# EAGLE design ESP32_Receptor (EAGLE 9.6.2)
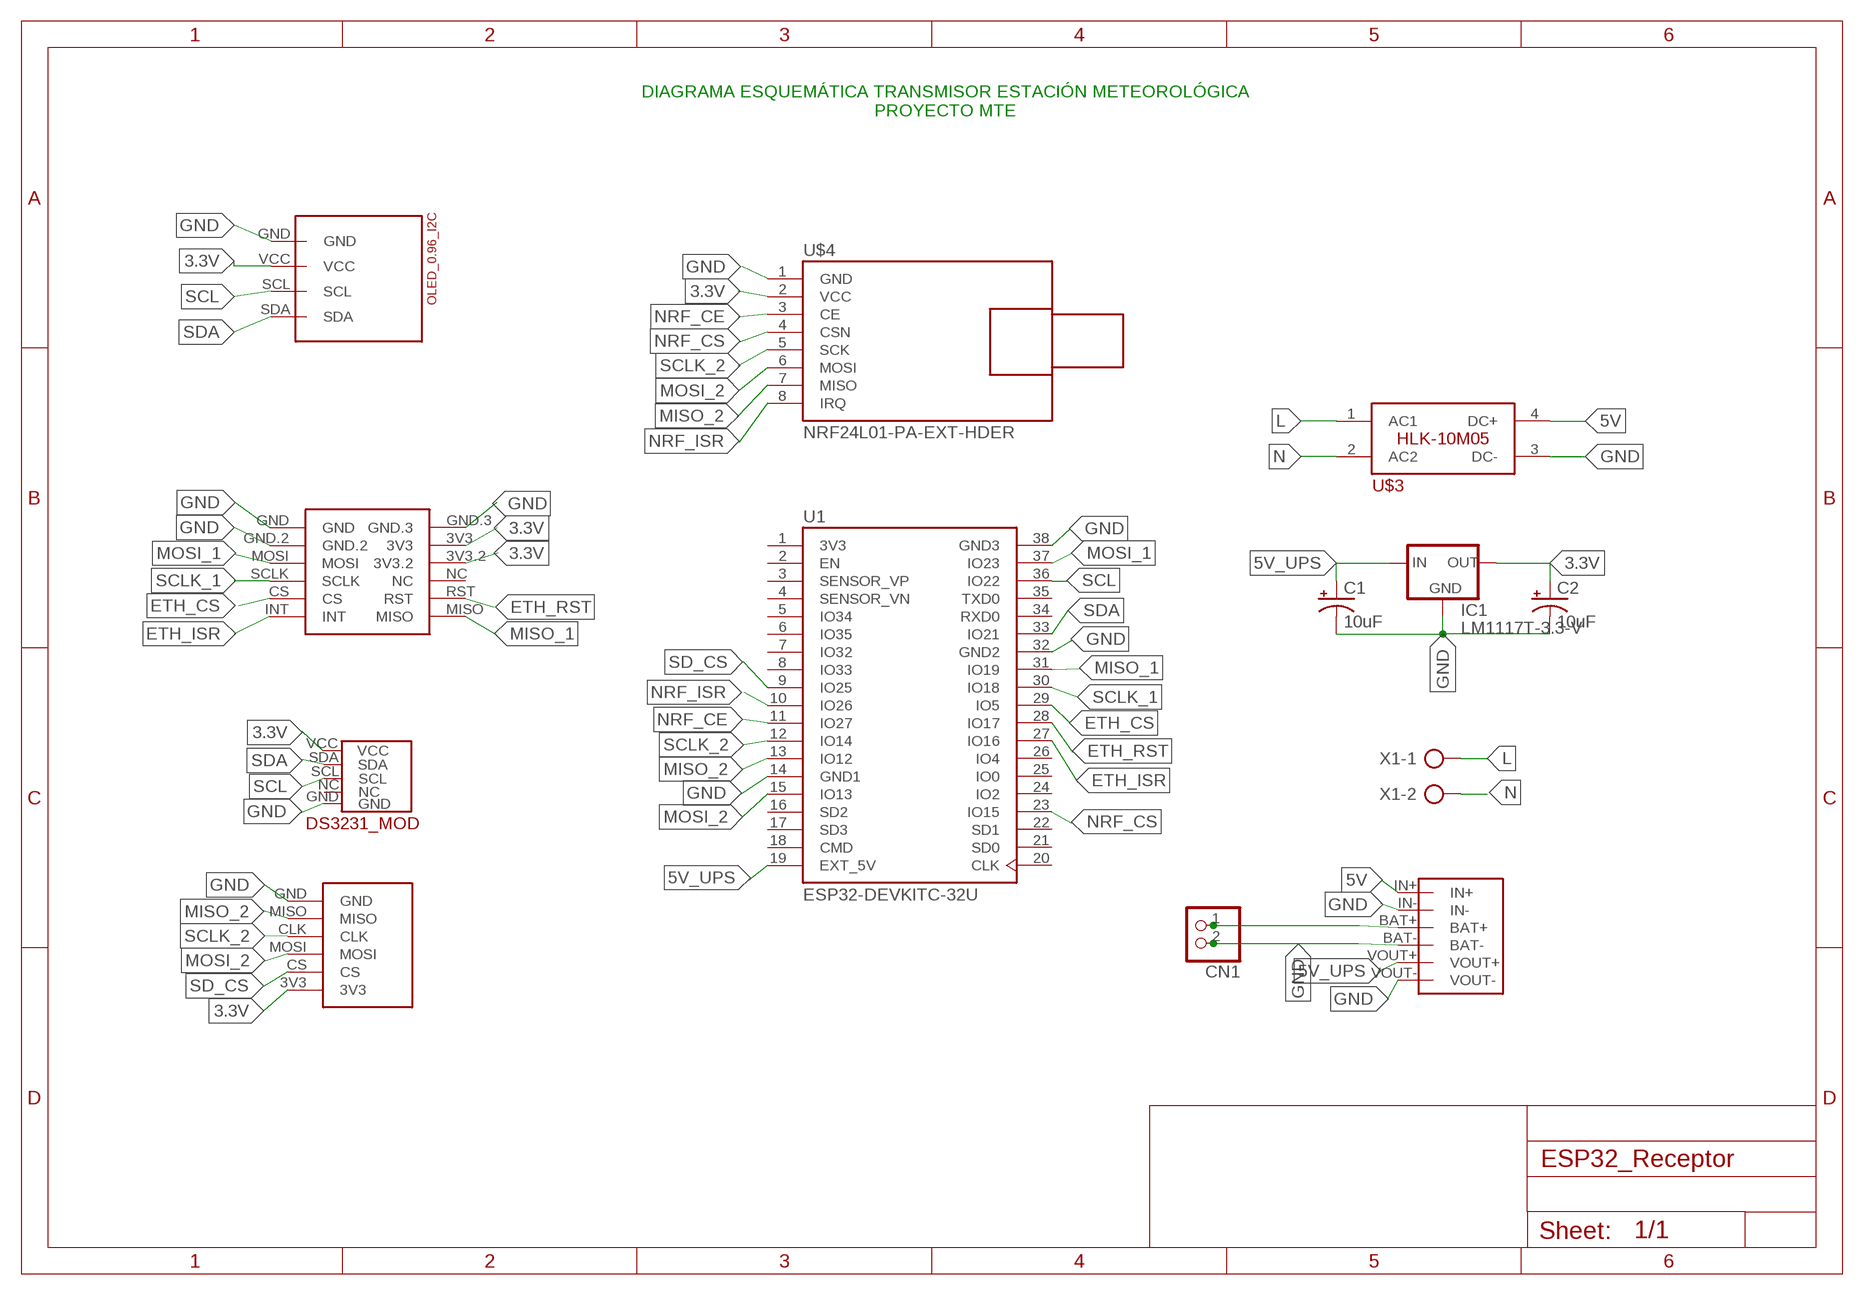
[diagram p0: schematic, sheet 1]

## Parts
C1  10uF  10UF-POLAR-RADIAL-2.5MM-25V-20%  [CPOL-RADIAL-2.5MM-5MM]
C2  10uF  10UF-POLAR-RADIAL-2.5MM-25V-20%  [CPOL-RADIAL-2.5MM-5MM]
CN1  JST_2PIN-THM  [JST-PH-2-THM]
IC1  LM1117T-3.3-V  [TO220V]
U1  ESP32-DEVKITC-32U  [MODULE_ESP32-DEVKITC-32U]
U$1  MINI_W5500  [MINI_W5500]
U$2  DS3231_MOD  [DS3231_MOD]
U$3  HLK-10M05  [HLK-10M05]
U$4  NRF24L01-PA-EXT-HDER  [NRF24L01-HEADER]
U$5  OLED_I2C_096  [OLED_096_I2C]
U$6  MODULO_MSD2  [MICROSD-BREAKOUT]
U$7  J5019_UPS  [J5019_UPS]
X1  AK500/2-H  [AK500/2-H]

## Nets
3.3V: C2.1(+) IC1.2(OUT) U$1.3V3 U$1.3V3.2 U$2.VCC U$4.2(VCC) U$5.VCC U$6.3V3
5V: U$3.4(DC+) U$7.IN+
5V_UPS: C1.1(+) IC1.3(IN) U1.19(EXT_5V) U$7.VOUT+
ETH_CS: U1.29(IO5) U$1.CS
ETH_ISR: U1.27(IO16) U$1.INT
ETH_RST: U1.28(IO17) U$1.RST
GND: C1.2(-) C2.2(-) CN1.2 IC1.1(GND) U1.14(GND1) U1.32(GND2) U1.38(GND3) U$1.GND U$1.GND.2 U$1.GND.3 U$2.GND U$3.3(DC-) U$4.1(GND) U$5.GND U$6.GND U$7.BAT- U$7.IN- U$7.VOUT-
L: U$3.1(AC1) X1.1
MISO_1: U1.31(IO19) U$1.MISO
MISO_2: U1.13(IO12) U$4.7(MISO) U$6.MISO
MOSI_1: U1.37(IO23) U$1.MOSI
MOSI_2: U1.15(IO13) U$4.6(MOSI) U$6.MOSI
N: U$3.2(AC2) X1.2
N$1: CN1.1 U$7.BAT+
NRF_CE: U1.11(IO27) U$4.3(CE)
NRF_CS: U1.23(IO15) U$4.4(CSN)
NRF_ISR: U1.10(IO26) U$4.8(IRQ)
SCL: U1.36(IO22) U$2.SCL U$5.SCL
SCLK_1: U1.30(IO18) U$1.SCLK
SCLK_2: U1.12(IO14) U$4.5(SCK) U$6.CLK
SD_CS: U1.9(IO25) U$6.CS
SDA: U1.33(IO21) U$2.SDA U$5.SDA
Unconnected: U1.2(EN) U1.3(SENSOR_VP) U1.4(SENSOR_VN) U1.5(IO34) U1.6(IO35) U1.7(IO32) U1.8(IO33) U1.16(SD2) U1.17(SD3) U1.18(CMD) U1.20(CLK) U1.21(SD0) U1.22(SD1) U1.24(IO2) U1.25(IO0) U1.26(IO4) U1.34(RXD0) U1.35(TXD0) U$1.NC U$2.NC

## Notes on the sheet
- DIAGRAMA ESQUEMÁTICA TRANSMISOR ESTACIÓN METEOROLÓGICA
  PROYECTO MTE

## Power pins joined to a net without a drawn wire
3V3: U1.1(3V3)

## Library data of the parts
C1 C2 = SparkFun-Capacitors:10UF-POLAR: 10.0µF polarized capacitors A capacitor is a passive two-terminal electrical component used to store electrical energy temporarily in an electric field.; PROD_ID: CAP-08440
CN1 = adafruit:JST_2PIN: JST 2-Pin Connectors of various flavors SMT-RA (S2B-PH-SM4) 4UConnector #17311 SMT (B2B-PH-SM4) THM-RA (S2B-PH) THM (B2B-PH)
IC1 = lm1117:LM1117T-*
U1 = ESP32-DEVKITC-32U:ESP32-DEVKITC-32U: ESP32-DEVKITC Check availability <https://pricing.snapeda.com/parts/ESP32-DEVKITC-32U/Espressif%20Systems/view-part?ref=eda>; AVAILABILITY: In Stock; CHECK_PRICES: https://www.snapeda.com/parts/ESP32-DEVKITC-32U/Espressif+Systems/view-part/?ref=eda; DESCRIPTION: ESP32-WROOM-32UE series Transceiver; 802.11 b/g/n (Wi-Fi, WiFi, WLAN), Bluetooth® Smart Ready 4.x Dual Mode Evaluation Board; MF: Espressif Systems; MP: ESP32-DEVKITC-32U; PACKAGE: CUSTOM-38 ESPRESSIF; PRICE: None; PURCHASE-URL: https://www.snapeda.com/api/url_track_click_mouser/?unipart_id=2781909&manufacturer=Espressif Systems&part_name=ESP32-DEVKITC-32U&search_term=None; SNAPEDA_LINK: https://www.snapeda.com/parts/ESP32-DEVKITC-32U/Espressif+Systems/view-part/?ref=snap
U$1 = ethernet-mikroavr:MINI_W5500: MINI ETHERNET W5500, CREATE BY MIKROAVR.COM
U$2 = DS3231_,MOD:DS3231_MOD
U$3 = HLK-10M05_V2:HLK-10M05; AVAILABILITY: Unavailable; MF: Hi-link; MP: hlk-pm01; PACKAGE: Package Analog Devices; PRICE: None
U$4 = NRF24L01-Header:NRF24L01-PA-EXT-HDER
U$5 = OLED_I2C:OLED_I2C_096
U$6 = MSD2:MODULO_MSD2
U$7 = POWER_SOURCES:J5019_UPS
X1 = con-ptr500:AK500/2-H: CONNECTOR Aug. 2004 / PTR Meßtechnik: Die Bezeichnung der Serie AK505 wurde geändert. Es handelt sich hierbei um AK500 in horizontaler Ausführung.; OC_FARNELL: unknown; OC_NEWARK: unknown

## Board
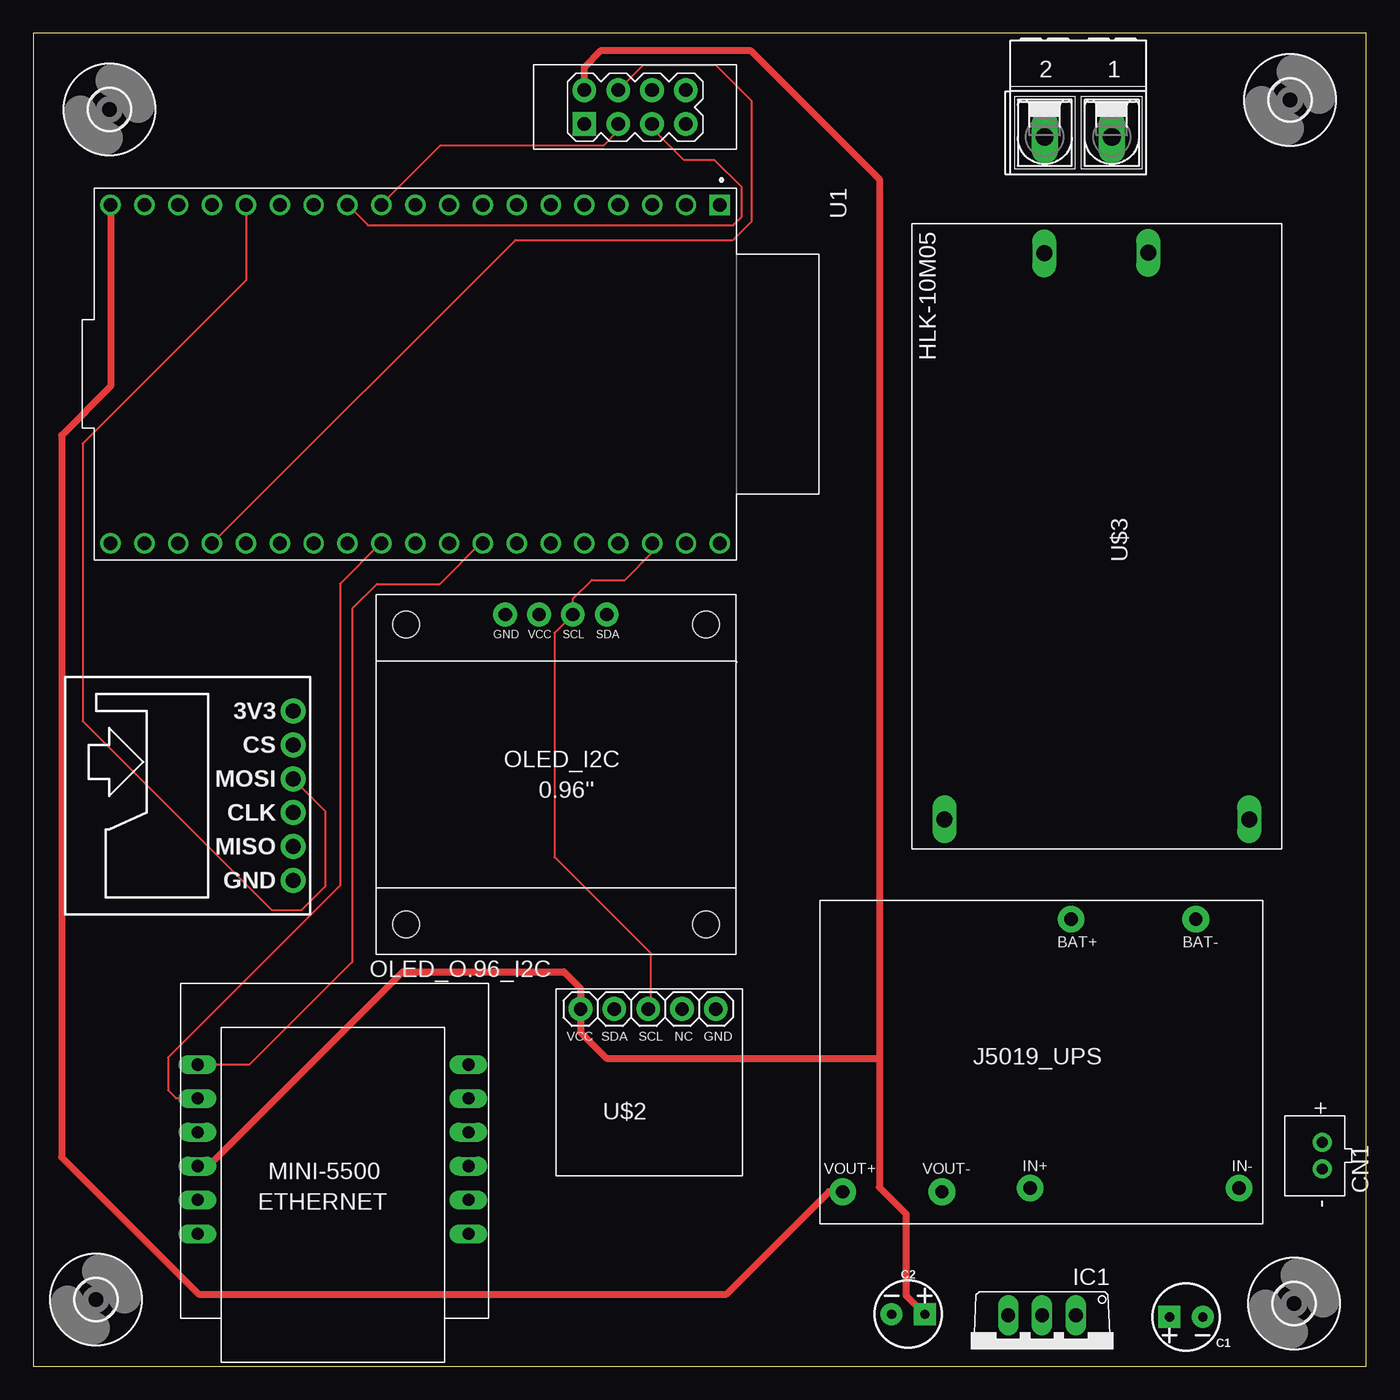
[diagram p1: board, top side]
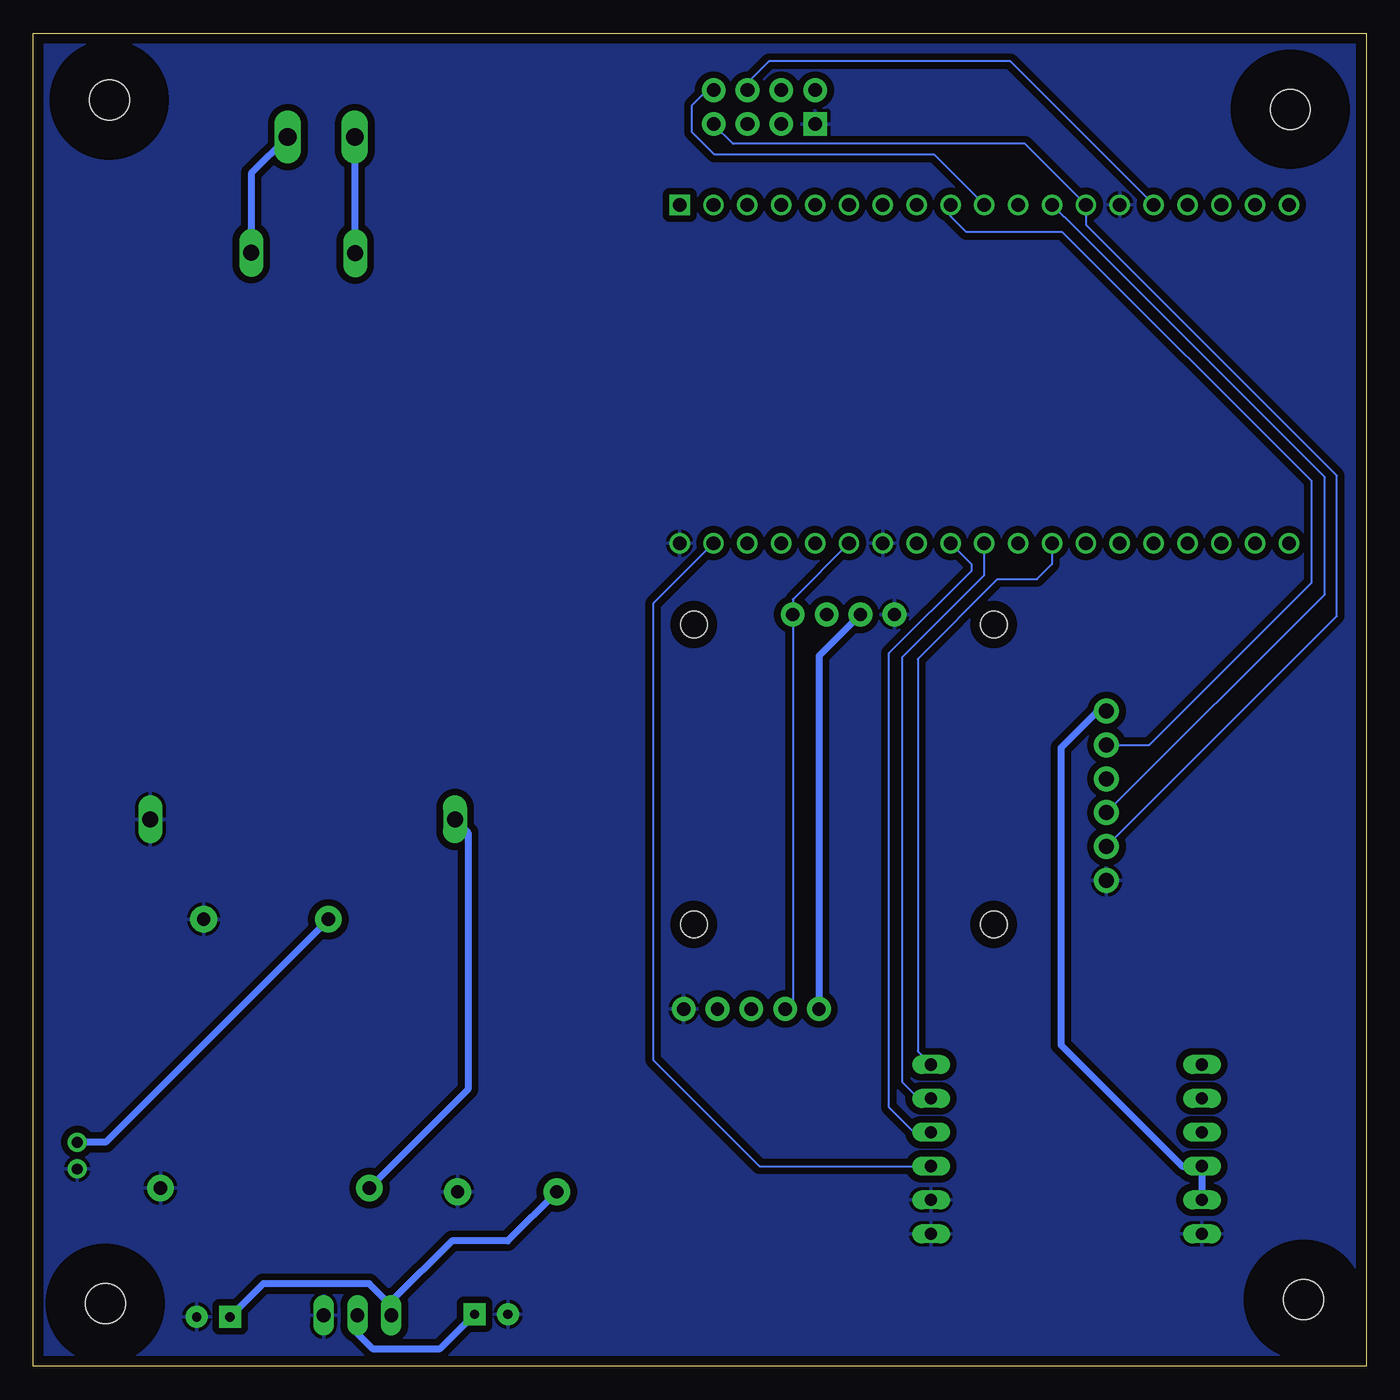
[diagram p2: board, bottom side, seen from below]

Size 100 x 100 mm. Coordinates in mm from the lower left corner, seen from the top.
Outline: 0,100 0,0 100,0 100,100 0,100
Copper layers (1*16): Top 0.035mm / dielectric 1.5mm / Bottom 0.035mm
Design rules "default *": minimum track width 6mil, minimum drill 0.3mm, track to track 20mil, track to pad 20mil, pad to pad 20mil, via to via 20mil, smd to smd 20mil, copper to edge 30mil, drill to drill 6mil, minimum pad ring 10mil, minimum via ring 8mil, stop-mask expansion 4mil, vias tented up to drill 0mil, thermal gap 10mil
Holes 3 mm at 4.7,5 5.7,94.3 94.3,95 94.6,4.7 4.7,5 5.7,94.3 94.3,95 94.6,4.7
Holes 2 mm at 27.95,33.15 50.45,33.15 50.45,55.65 27.95,55.65 27.95,33.15 50.45,33.15 50.45,55.65 27.95,55.65

### Footprints (pad centres in the part's own frame; a part is rotated, then mirrored left to right if it is on the bottom)
CPOL-RADIAL-2.5MM-5MM = drill 0.7 pad 1.651 square: 1 1.25,0 | drill 0.7 pad 1.651: 2 -1.25,0
JST-PH-2-THM = drill 0.8 pad 1.422: 1 1,0; 2 -1,0
TO220V = drill 1.016 long: 1 -2.54,-2.54; 2 0,-2.54; 3 2.54,-2.54
MODULE_ESP32-DEVKITC-32U = drill 1.02 square: 1 -12.7,22.85 | drill 1.02: 2 -12.7,20.31; 3 -12.7,17.77; 4 -12.7,15.23; 5 -12.7,12.69; 6 -12.7,10.15; 7 -12.7,7.61; 8 -12.7,5.07; 9 -12.7,2.53; 10 -12.7,-0.01; 11 -12.7,-2.55; 12 -12.7,-5.09; 13 -12.7,-7.63; 14 -12.7,-10.17; 15 -12.7,-12.71; 16 -12.7,-15.25; 17 -12.7,-17.79; 18 -12.7,-20.33; 19 -12.7,-22.87; 20 12.7,-22.87; 21 12.7,-20.33; 22 12.7,-17.79; 23 12.7,-15.25; 24 12.7,-12.71; 25 12.7,-10.17; 26 12.7,-7.63; 27 12.7,-5.09; 28 12.7,-2.55; 29 12.7,-0.01; 30 12.7,2.53; 31 12.7,5.07; 32 12.7,7.61; 33 12.7,10.15; 34 12.7,12.69; 35 12.7,15.23; 36 12.7,17.77; 37 12.7,20.31; 38 12.7,22.85
MINI_W5500 = drill 0.914 long: 3V3 21.844,-8.89; 3V3.2 21.844,-11.43; CS 1.524,-16.51; GND 1.524,-6.35; GND.2 1.524,-8.89; GND.3 21.844,-6.35; INT 1.524,-19.05; MISO 21.844,-19.05; MOSI 1.524,-11.43; NC 21.844,-13.97; RST 21.844,-16.51; SCLK 1.524,-13.97
DS3231_MOD = drill 1 pad 1.778: GND 5.01,5.51; NC 2.47,5.51; SCL -0.07,5.51; SDA -2.61,5.51; VCC -5.15,5.51
HLK-10M05 = drill 1.2 long: 1 -14.827,7.745; 2 -14.789,-0.049; 3 27.667,15.32; 4 27.679,-7.535
NRF24L01-HEADER = drill 1 pad 1.778 square: 1 -1.335,3.91 | drill 1.016 pad 1.778: 2 1.205,3.91; 3 -1.335,1.37; 4 1.205,1.37; 5 -1.335,-1.17; 6 1.205,-1.17; 7 -1.335,-3.71; 8 1.205,-3.71
OLED_096_I2C = drill 1 pad 1.778: GND -3.8,12; SCL 1.28,12; SDA 3.82,12; VCC -1.26,12 | hole 2: -11.25,11.25; -11.25,-11.25; 11.25,-11.25; 11.25,11.25
MICROSD-BREAKOUT = drill 1.118 pad 1.88: 3V3 -5.89,8.7; CLK 1.73,8.7; CS -3.35,8.7; GND 6.81,8.7; MISO 4.27,8.7; MOSI -0.81,8.7
J5019_UPS = drill 1 pad 2: BAT+ 18.855,22.829; BAT- 28.22,22.829; IN+ 15.777,2.666; IN- 31.454,2.666; VOUT+ 1.718,2.385; VOUT- 9.169,2.385
3,0 = hole 3: 0,0
AK500/2-H = drill 1.321 long: 1 -2.515,0; 2 2.515,0

### Placement (x,y rotation side)
C1  86.49,3.7 180 top
C2  65.64,3.9 0 top
CN1  96.7,15.8 90 top
IC1  75.68,1.28 180 top
U1  28.66,74.44 270 top
U$1  34.17,3.58 180 top
U$2  46.2,21.29 0 top
U$3  75.9,68.7 270 top
U$4  45.25,94.53 90 top
U$5  39.2,44.4 0 top
U$6  10.78,43.26 270 top
U$7  59,10.7 0 top
U$8  [3,0]  5.7,94.3 0 top
U$9  [3,0]  94.3,95 0 top
U$10  [3,0]  94.6,4.7 0 top
U$11  [3,0]  4.7,5 0 top
X1  78.4,92.22 180 top

### Tracks (layer width: path | path; a pad name or v marks a point on that pad's centre or on a via)
3.3V
  Top 0.508: U$4.2 41.34,97.47 42.6,98.73 53.8,98.73 63.47,89.06 63.47,23.1 | U$1.3V3.2 13.13,15.01 27.72,29.6 39.8,29.6 41.05,28.35 U$2.VCC 41.05,25.05 43,23.1 63.47,23.1 | 63.47,23.1 63.47,13.44 65.5,11.4 65.5,5.29 C2.1
  Bottom 0.508: C2.1 69.52,1.27 74.5,1.27 75.68,2.45 IC1.2 | U$2.VCC 41.05,53.29 U$5.VCC | U$6.3V3 20.15,49.15 22.9,46.4 22.9,24.1 13.81,15.01 U$1.3V3.2 U$1.3V3
5V
  Bottom 0.508: U$7.IN+ 67.39,20.76 67.39,40.04 U$3.4
5V_UPS
  Top 0.508: U1.19 5.79,73.51 2.11,69.84 2.11,15.69 12.4,5.4 52,5.4 59.69,13.09 U$7.VOUT+
  Bottom 0.508: U$7.VOUT+ 64.4,9.4 68.6,9.4 73.14,4.86 IC1.3 73.14,4.54 74.8,6.2 82.74,6.2 C1.1
ETH_CS
  Bottom 0.152: U$1.CS 33.59,20.09 34.8,21.3 34.8,53.2 28.65,59.35 U1.29
ETH_ISR
  Bottom 0.152: U$1.INT 33.65,23.63 33.65,53.05 27.65,59.05 24.7,59.05 23.57,60.17 U1.27
ETH_RST
  Top 0.152: U1.28 26.04,61.74 23,58.7 23,36.06 10.1,23.16 10.1,20.7 10.71,20.09 U$1.RST
GND
  pour Bottom (isolate 0.406): 0,0 0,100 100,100 100,0
L
  Bottom 0.508: U$3.1 83.64,89.49 X1.1
MISO_1
  Top 0.152: U$1.MISO 16.23,22.63 23.93,30.33 23.93,56.83 25.8,58.7 30.5,58.7 33.54,61.74 U1.31
MISO_2
  Bottom 0.152: U$4.7 48.96,93.16 47.5,91.7 25.59,91.7 U1.13 21.03,85.64 2.2,66.81 2.2,56.27 U$6.MISO
MOSI_1
  Bottom 0.152: U1.37 53.5,57.21 53.5,23 45.51,15.01 U$1.MOSI
MOSI_2
  Top 0.152: U1.15 15.95,81.49 3.69,69.24 3.69,48.41 17.9,34.2 20.1,34.2 21.9,36 21.9,41.65 U$6.MOSI
  Bottom 0.152: U1.15 26.71,97.9 44.8,97.9 46.42,96.28 U$4.6
N
  Bottom 0.508: U$3.2 75.89,83.52 X1.2
N$1
  Bottom 0.508: CN1.1 94.58,16.8 U$7.BAT+
NRF_CE
  Top 0.152: U1.11 30.57,91.6 42.8,91.6 43.88,92.68 U$4.3
NRF_CS
  Top 0.152: U1.23 36.17,84.5 52.5,84.5 53.9,85.9 53.9,94.91 51.2,97.61 45.75,97.61 U$4.4
NRF_ISR
  Bottom 0.152: U1.10 32.41,90.9 48.9,90.9 50.6,92.6 50.6,94.6 49.47,95.73 U$4.8
SCL
  Top 0.152: U$2.SCL 46.3,26.97 46.3,31 39.1,38.2 39.1,55.02 U$5.SCL 40.5,56.42 40.5,57.6 41.9,59 44.4,59 46.43,61.03 U1.36
SCLK_1
  Bottom 0.152: U$1.SCLK 33.95,17.55 35.8,19.4 35.8,53.5 29.6,59.7 29.6,60.15 U1.30
SCLK_2
  Top 0.152: U1.12 25.11,85.6 52.5,85.6 53.15,86.25 53.15,88.45 51.1,90.5 48.8,90.5 46.5,92.8 46.5,93.19 U$4.5
  Bottom 0.152: U$6.CLK 3.1,57.91 3.1,66.7 22.64,86.24 22.67,86.24 U1.12
SD_CS
  Bottom 0.152: U$6.CS 16.28,46.61 4.1,58.79 4.1,66.4 22.8,85.1 30,85.1 31.19,86.29 U1.9
SDA
  Bottom 0.152: U1.33 43.02,57.53 U$5.SDA 43.02,27.37 U$2.SDA